# EAGLE design MCP3425-1 (EAGLE 9.6.2)
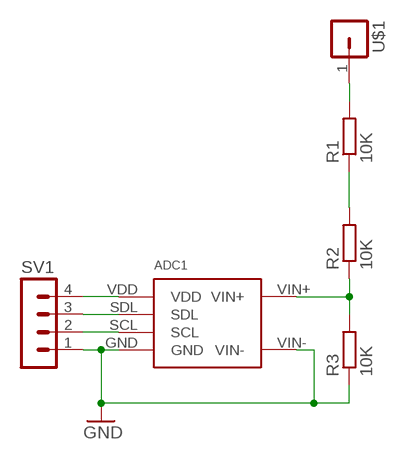
[diagram p0: schematic, sheet 1]

## Parts
ADC1  MCP3425MOD  [MCP3425MOD]
R1  10K  R-EU_0204/5  [0204/5]
R2  10K  R-EU_0204/5  [0204/5]
R3  10K  R-EU_0204/5  [0204/5]
SV1  PINHEAD-MA04-1  [PINHEAD-MA04-1]
U$1  PINHEAD-MA01-1  [PINHEAD-MA01-1]

## Nets
GND: ADC1.GND ADC1.VIN- R3.1 SV1.1
N$1: ADC1.VDD SV1.4
N$2: ADC1.SDL SV1.3
N$3: ADC1.SCL SV1.2
N$4: R1.2 U$1.1
N$5: ADC1.VIN+ R2.1 R3.2
N$6: R1.1 R2.2

## Library data of the parts
ADC1 = ytani1:MCP3425MOD: MCP3425(16Bit ADC I2C 基準電圧内蔵)搭載モジュール; URL_AKIZUKI: https://akizukidenshi.com/catalog/g/gK-08018/
R1-R3 = rcl:R-EU_: RESISTOR, European symbol; SPICEPREFIX: R
SV1 = ytani1:PINHEAD-MA04-1: PIN HEADER; OC_FARNELL: unknown; OC_NEWARK: unknown
U$1 = ytani1:PINHEAD-MA01-1

## Board
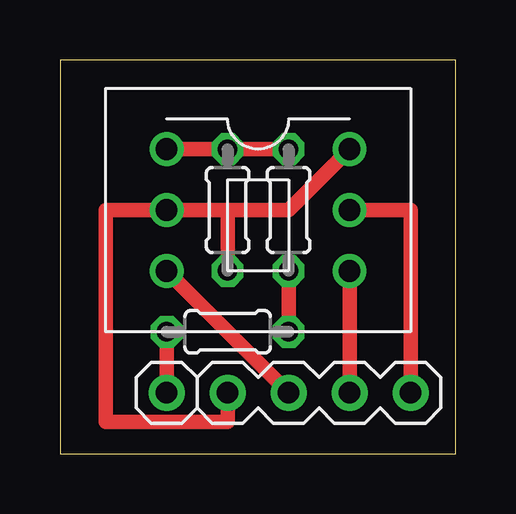
[diagram p1: board, top side]

Size 16.49 x 16.42 mm. Coordinates in mm from the lower left corner, seen from the top.
Outline: 0,0 16.49,0 16.49,16.42 0,16.42 0,0
Copper layers (1*16): Top 0.035mm / dielectric 1.5mm / Bottom 0.035mm
Design rules "default": minimum track width 6mil, minimum drill 0.35mm, track to track 6mil, track to pad 6mil, pad to pad 6mil, via to via 6mil, smd to smd 6mil, copper to edge 40mil, drill to drill 6mil, minimum pad ring 10mil, minimum via ring 8mil, stop-mask expansion 4mil, vias tented up to drill 0mil, thermal gap 10mil

### Footprints (pad centres in the part's own frame; a part is rotated, then mirrored left to right if it is on the bottom)
MCP3425MOD = drill 0.9: GND -2.54,0; SCL -2.54,-2.54; SDL 5.08,-2.54; VDD 5.08,0; VIN+ -2.54,2.54; VIN- 5.08,2.54
0204/5 = drill 0.813 octagon: 1 -2.54,0; 2 2.54,0
PINHEAD-MA04-1 = drill 0.9 pad 1.5: 1 -3.81,0; 2 -1.27,0; 3 1.27,0; 4 3.81,0
PINHEAD-MA01-1 = drill 0.9 pad 1.5: 1 1.27,0

### Placement (x,y rotation side)
ADC1  6.99,10.16 0 top
R1  6.99,5.08 180 top
R2  9.53,10.16 270 top
R3  6.99,10.16 90 top
SV1  10.79,2.54 0 top
U$1  4.45,3.81 270 top

### Tracks (layer width: path | path; a pad name or v marks a point on that pad's centre or on a via)
GND
  Top 0.61: 6.99,10.16 ADC1.GND 1.91,10.16 1.91,1.32 6.99,1.32 SV1.1 | 6.99,10.16 9.53,10.16 ADC1.VIN- | R3.1 6.99,10.16
N$1
  Top 0.61: ADC1.VDD 14.61,10.16 SV1.4
N$2
  Top 0.61: ADC1.SDL SV1.3
N$3
  Top 0.61: SV1.2 ADC1.SCL
N$4
  Top 0.61: U$1.1 R1.2
N$5
  Top 0.61: ADC1.VIN+ R3.2 R2.1
N$6
  Top 0.61: R2.2 R1.1